# Altium schematic sheet layout_test_slave1a.SchDoc
size B
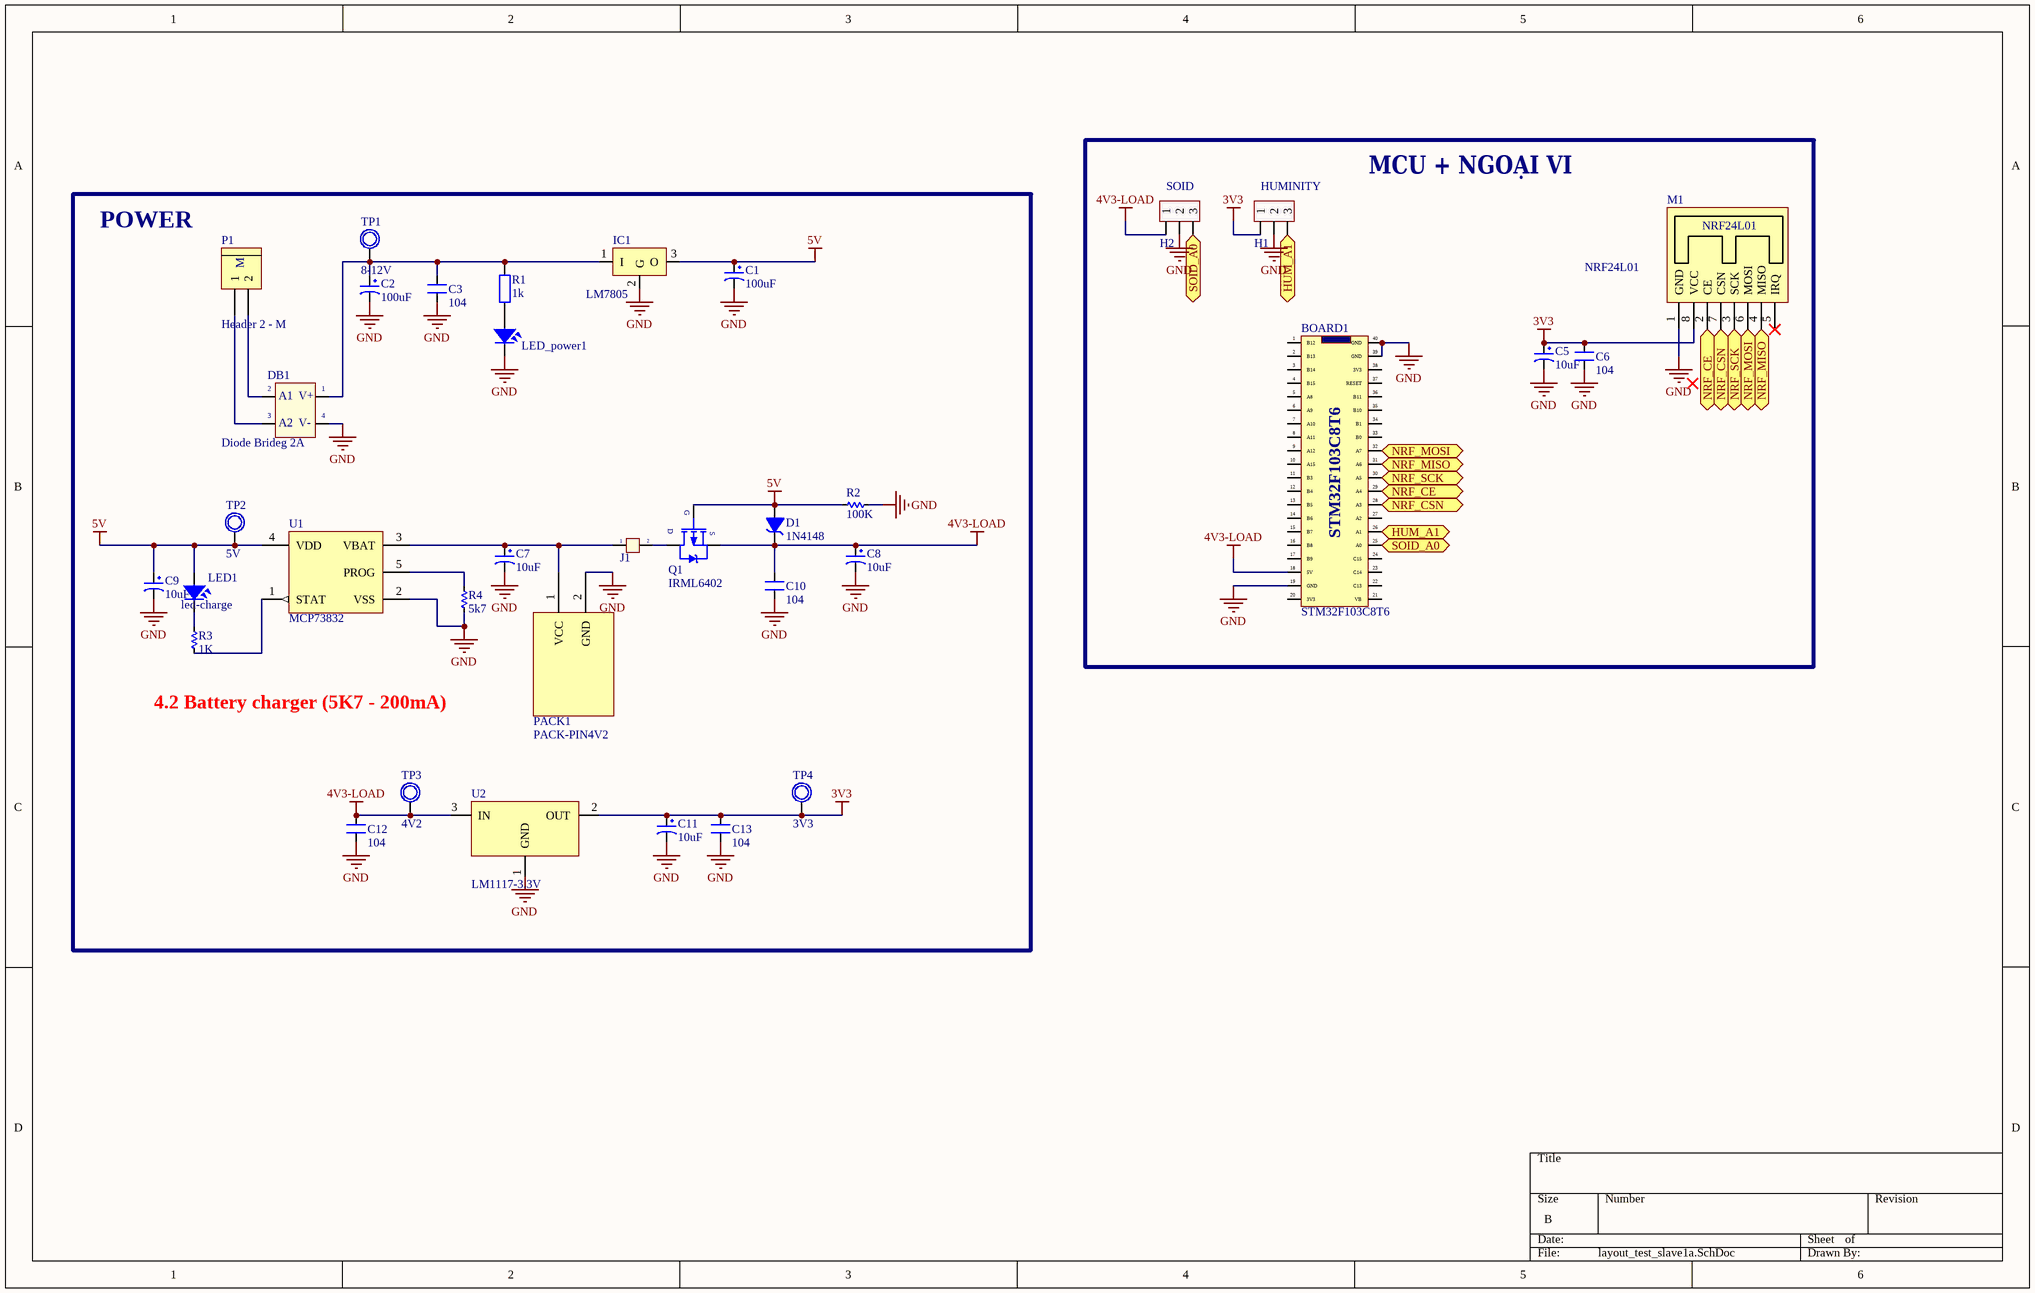
[diagram p0: layout_test_slave1a.SchDoc]

## Parts
BOARD1  STM32F103C8T6  [BOARD STM32F103C8T6 - duplicate]
C1  100uF  [CP1/2.5]
C2  100uF  [CP1/2.5]
C3  104  [SM-CAP-0805]
C5  10uF  [CP1/2]
C6  104  [SM-CAP-0805]
C7  10uF  [CP1/2]
C8  10uF  [CP1/2]
C9  10uF  [CP1/2]
C10  104  [SM-CAP-0805]
C11  10uF  [CP1/2]
C12  104  [SM-CAP-0805]
C13  104  [SM-CAP-0805]
D1  1N4148  [DZ1A]
DB1  Diode Brideg 2A  [DIO-Bri 2A]
H1  HUMINITY  [HDR3]
H2  SOID  [HDR3]
IC1  LM7805  [TO252-123]
J1  Jumper 2  [JP2]  (value not drawn)
LED1  led-charge  [LED-5-BLUE]
LED_power1  LED  [LED-5-BLUE]  (value not drawn)
M1  NRF24L01  [NRF24L01]
P1  Header 2 - M  [Medium - Header 2]
PACK1  PACK-PIN4V2  [battery holder]
Q1  IRML6402  [SOT23-123]
R1  1k  [R1/4W]
R2  100K  [RES-1/4W-SMALL]
R3  1K  [RES-1/4W-SMALL]
R4  5k7  [RES-1/4W-SMALL]
TP1  8-12V  [TP1]
TP2  5V  [TP1]
TP3  4V2  [TP1]
TP4  3V3  [TP1]
U1  MCP73832  [SOT-23-OT5_N]
U2  LM1117-3.3V  [SOT223]

## Ports
HUM_A1, NRF_CE, NRF_CSN, NRF_MISO, NRF_MOSI, NRF_SCK, SOID_A0

## Nets
3V3: C5.1 C6.2 C11.1 C13.2 H1.1 M1.8(VCC) TP4.1 U2.2(OUT)
4V3-LOAD: BOARD1.18(5V) C8.1 C10.2 C12.2 D1.2(K) H2.1 Q1.3(S) TP3.1 U2.3(IN)
5V: C1.1 C9.1 D1.1(A) IC1.3(O) LED1.1 Q1.1(G) R2.2 TP2.1 U1.4(VDD)
GND: BOARD1.19(GND) BOARD1.39(GND) BOARD1.40(GND) C1.2 C2.2 C3.1 C5.2 C6.1 C7.2 C8.2 C9.2 C10.1 C11.2 C12.1 C13.1 DB1.4(-V_OUT) H1.2 H2.2 IC1.2(G) LED_power1.2 M1.1(GND) PACK1.2(GND) R2.1 R4.2 U1.2(VSS) U2.1(GND)
HUM_A1: BOARD1.26(A1) H1.3 ; port HUM_A1
NRF_CE: BOARD1.29(A4) M1.2(CE) ; port NRF_CE
NRF_CSN: BOARD1.28(A3) M1.7(CSN) ; port NRF_CSN
NRF_MISO: BOARD1.31(A6) M1.4(MISO) ; port NRF_MISO
NRF_MOSI: BOARD1.32(A7) M1.6(MOSI) ; port NRF_MOSI
NRF_SCK: BOARD1.30(A5) M1.3(SCK) ; port NRF_SCK
SOID_A0: BOARD1.25(A0) H2.3 ; port SOID_A0
NetC2_1: C2.1 C3.2 DB1.1(+V_OUT) IC1.1(I) R1.2 TP1.1
NetC7_1: C7.1 J1.1 PACK1.1(VCC) U1.3(VBAT)
NetDB1_2: DB1.2(AC1) P1.2
NetDB1_3: DB1.3(AC2) P1.1
NetJ1_2: J1.2 Q1.2(D)
NetLED1_2: LED1.2 R3.1
NetLED_power1_1: LED_power1.1 R1.1
NetR3_2: R3.2 U1.1(STAT)
NetR4_1: R4.1 U1.5(PROG)

Not connected (* = marked no-connect by the designer): BOARD1 1(B12) 2(B13) 3(B14) 4(B15) 5(A8) 6(A9) 7(A10) 8(A11) 9(A12) 10(A15) 11(B3) 12(B4) 13(B5) 14(B6) 15(B7) 16(B8) 17(B9) 20(3V3) 21(VB) 22(C13) 23(C14) 24(C15) 27(A2) 33(B0) 34(B1) 35(B10) 36(B11) 37(RESET) 38(3V3); M1 5(IRQ)*

## Notes on the sheet
- POWER
- MCU + NGOẠI VI
- (near R3) 4.2 Battery charger (5K7 - 200mA)
- (in symbol DIODE BRIGDE) A1; V+; A2; V-
- (in symbol Header 2 - M) M

## Library data of the parts
BOARD1 = board stm32f103c8t6
C1 C2 = CP2: C 47uF/50V , 220uF/16V; Value: 47uF/16 - 50V; Description 1: 470uF/6,3V - 330uF/10V - 220uF/16V; Description 2: 100uF/25V - 35V - 47uF/50V - 22uF/100V; Description 3: 33uF => 47uF/63V - 1uF => 4,7uF/160V; Description 4: 1uF => 2,2uF/250V - 1uF/350V
C3 C6 C10 C12 C13 = CN: Value: 0,1uF/300V; Designed by: VanDungEvn
C5 C7-C9 C11 = CP1: Cap P  0,1uF < 22uF , 16 - 50V; Value: 10uF/50V; Description 1: 10 => 220uF/6,3V/10V - 10uF => 100uF/16V; Description 2: 0,1uF => 33uF/50V - 10uF => 22uF/63V; Description 3: 0,47uF => 10uF/100V
D1 = DZ: Diode Zenner; Value: 3v3
DB1 = DIODE BRIGDE: Convert AC to DC voltage, 4 pin; Value: Cau 1A
H1 H2 = Header3: Header IDC, 3 x 1 Pin Vertical 2.54mm Pitch (Non-Boxed, Male)
IC1 = LM78xx: Positive Voltage Regulator; Note: Tab is connected to pin 3 (GND).; Published: 24-Aug-2001; LatestRevisionDate: 17-Jul-2002; LatestRevisionNote: Re-released for DXP Platform.; DatasheetVersion: Apr-1994; PackageVersion: Jul-1998; PackageReference: ISOWATT220AB; Publisher: Altium Limited; PackageDescription: TO, Thru-Hole, Vertical, Heatsink Mounted; 3 In-Line Leads; Pitch 2.54 mm; Pin sequence 1, 3, 2; ComponentLink1Description: Manufacturer Link; ComponentLink1URL: http://www.st.com/; ComponentLink2Description: Datasheet; ComponentLink2URL: http://www.st.com/stonline/products/literature/ds/2146/l78m05c.pdf
J1 = JP 2: Value: JP 2
LED1 LED_power1 = LED: LED Single colour Green and Red; Value: LED 3 ly Single Colour
P1 = Header 2 - M: Header, 2-Pin, Medium; LatestRevisionDate: 17-Jul-2002; LatestRevisionNote: Re-released for DXP Platform.; Publisher: Altium Limited
PACK1 = pack pin 4V2
Q1 = IRF9540: HEXFET P-Channel Power MOSFET; Value: IRF840
R1 = R1/4W: Resistor 1/4W; Value: R1/4W - 1K
R2-R4 = Res: Manufacturer: Generic Components; Class: Passive; SubClass: R; Published: 08/06/2000; Publisher: Altium Hobart Technology Centre
TP1-TP4 = TP1: Test Point; Value: Test Point
U1 = MCP73831T-3ACI/OT: Miniature Single-Cell, Fully Integrated Li-Ion, Li-Polymer Charge Management Controller, 4.35V, 5-Pin SOT-23, Industrial Temperature, Tape and Reel; Published: 29-Jan-2009; LatestRevisionDate: 27-Nov-2009; LatestRevisionNote: Updated to datasheet revision E, Sep-2008; DatasheetVersion: revE, Sep-2008; PackageVersion: revBB, Aug-2009; PackageReference: SOT-23-OT5; Publisher: Altium Limited; PackageDescription: 5-Lead Plastic Small Outline Transistor (OT) [SOT-23]; Supplier 1: Digi-Key; Supplier Part Number 1: MCP73831T-3ACI/OT-ND; Code_IPC: SOT23-5; ComponentLink1Description: Datasheet; ComponentLink1URL: http://ww1.microchip.com/downloads/en/DeviceDoc/21984e.pdf; ComponentLink2Description: Packaging Specification; ComponentLink2URL: http://www.microchip.com/stellent/groups/techpub_sg/documents/packagingspec/en012702.pdf; ComponentLink3Description: Microchip.com Home; ComponentLink3URL: http://www.microchip.com/
U2 = LM1117: 800mA Low-Dropout Linear Regulator; Creator: Nguyen Ba Bien; Website: http://group3i.net